# Altium schematic sheet [Top Sheet].SchDoc: Top Sheet
size A4; Organization: My Company; Address1: Address Line 1; Address2: Address Line 2; Address3: Address Line 3; Address4: Address Line 4; SheetNumber: 1; SheetTotal: 2
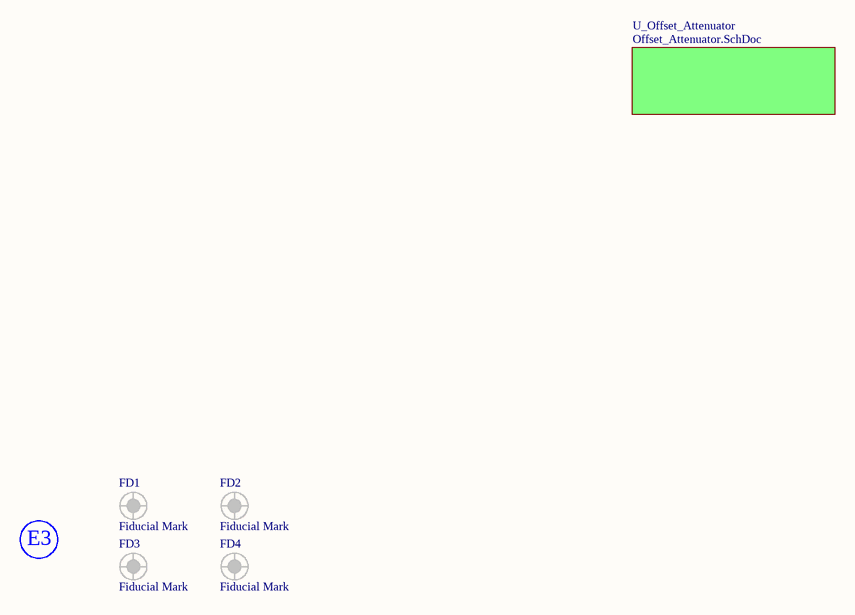
[diagram p0: [Top Sheet].SchDoc]

## Parts
?  E3 Silk  [E3 Silk Screen]  (value not drawn)
FD1  Fiducial Mark  [Fiducial Mark]  (no BOM)
FD2  Fiducial Mark  [Fiducial Mark]  (no BOM)
FD3  Fiducial Mark  [Fiducial Mark]  (no BOM)
FD4  Fiducial Mark  [Fiducial Mark]  (no BOM)

## Sub-sheets
U_Offset_Attenuator = Offset_Attenuator.SchDoc: no entries

## Notes on the sheet
- Title:
- Engineer:
- Date:
- Variant:
- REV:
- Prj:
- Edited:
- Sheet:
- Approved By:
- Reviewed By:
- File:
- (in symbol E3 Silk) E3

## Library data of the parts
FD1-FD4 = Fiducial Mark: Manufacturer: Custom; Vendor: Custom; Manufacturer P/N: Fiducial Mark; Vendor P/N: Fiducial Mark